# Altium schematic sheet PowerUnit.SchDoc
size A4
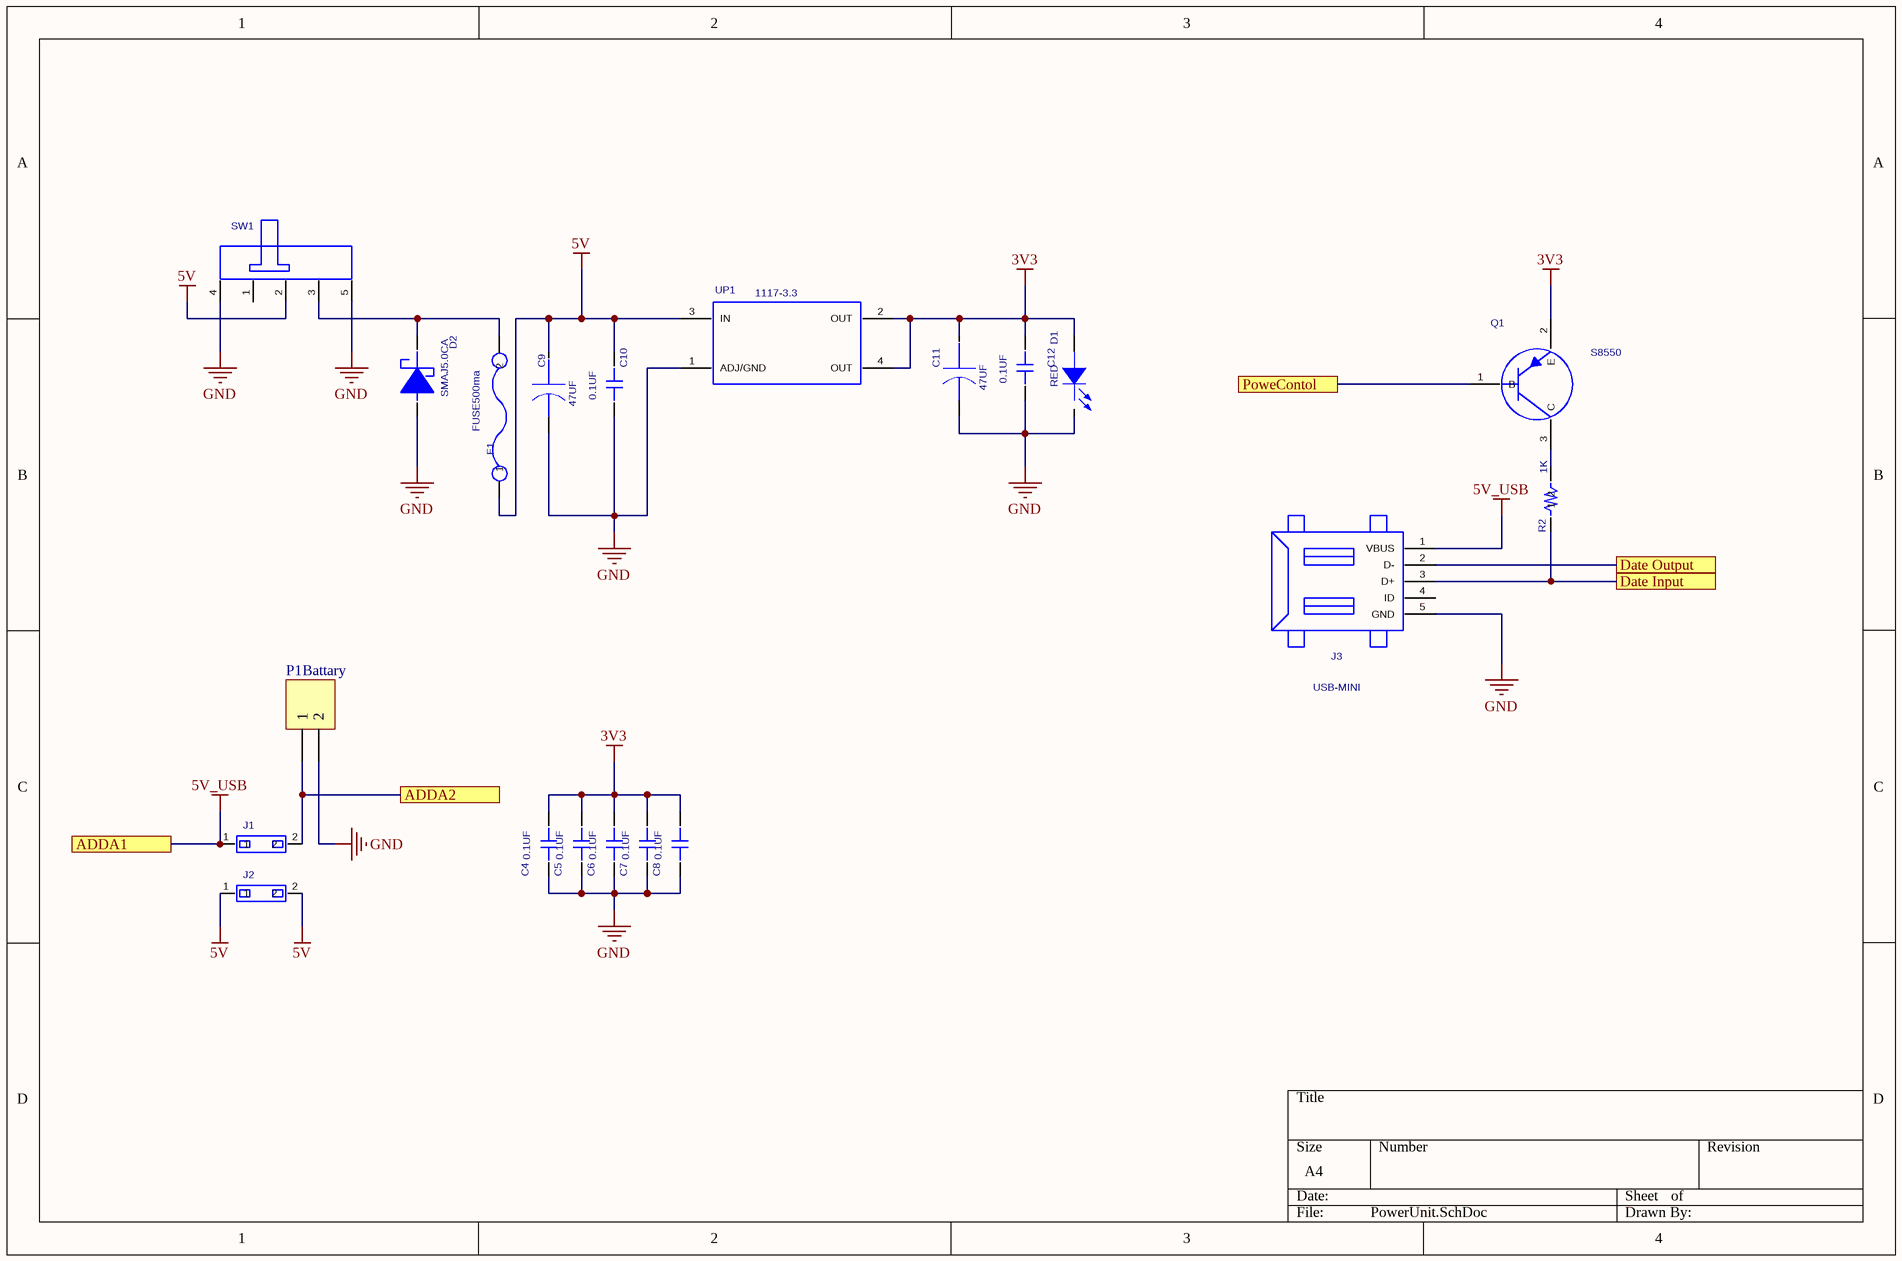
[diagram p0: PowerUnit.SchDoc]

## Parts
C4  value 0.1UF  [CAP_0603_FIRE]  (hidden comment: CAP_0.1UF_0603_FIRE)
C5  value 0.1UF  [CAP_0603_FIRE]  (hidden comment: CAP_0.1UF_0603_FIRE)
C6  value 0.1UF  [CAP_0603_FIRE]  (hidden comment: CAP_0.1UF_0603_FIRE)
C7  value 0.1UF  [CAP_0603_FIRE]  (hidden comment: CAP_0.1UF_0603_FIRE)
C8  value 0.1UF  [CAP_0603_FIRE]  (hidden comment: CAP_0.1UF_0603_FIRE)
C9  value 47UF  [CAP+_47UF_FIRE]  (hidden comment: CAP+_47UF_FIRE)
C10  value 0.1UF  [CAP_0603_FIRE]  (hidden comment: CAP_0.1UF_0603_FIRE)
C11  value 47UF  [CAP+_47UF_FIRE]  (hidden comment: CAP+_47UF_FIRE)
C12  value 0.1UF  [CAP_0603_FIRE]  (hidden comment: CAP_0.1UF_0603_FIRE)
D1  value RED  [LED_RED_0603_FIRE]  (hidden comment: LED_RED_0603_FIRE)
D2  SMAJ5.0CA  [DO-214]
F1  FUSE500MA  [C1812]
J1  1X2PIN_SMD  [1X2PIN_SMD]  (value not drawn)
J2  1X2PIN_SMD  [1X2PIN_SMD]  (value not drawn)
J3  USB-MINI  [USB-MINI]
P1  Battary  [HDR1X2]
Q1  S8550  [SOT-23]
R2  value 1K  [RES_0603_FIRE]  (hidden comment: RES_1K_0603_FIRE)
SW1  SW-POWER  [SW13_6]  (value not drawn)
UP1  1117-3.3

## Ports
ADDA1, ADDA2, Date Input, Date Output, PoweContol

## Nets
3V3: C4.2 C5.2 C6.2 C7.2 C8.2 C11.1 C12.2 D1.A(ANODE) Q1.2(E) UP1.2(OUT) UP1.4(OUT)
5V: C9.1 C10.2 F1.1 J2.1 J2.2 SW1.2 UP1.3(IN)
5V_USB: J1.1 J3.1(VBUS) ; port ADDA1
GND: C4.1 C5.1 C6.1 C7.1 C8.1 C9.2 C10.1 C11.2 C12.1 D1.K(CATHODE) D2.1(+) J3.5(GND) P1.2 SW1.4 SW1.5 UP1.1(ADJ/GND)
ADDA2: J1.2 P1.1 ; port ADDA2
Date Input: J3.3(D+) R2.1 ; port Date Input
Date Output: J3.2(D-) ; port Date Output
PoweContol: Q1.1(B) ; port PoweContol
NetD2_2: D2.2(-) F1.2 SW1.3
NetQ1_3: Q1.3(C) R2.2

Not connected (* = marked no-connect by the designer): J3 4(ID); SW1 1

## Library data of the parts
C4-C8 C10 C12 = CAP_0.1UF_0603_FIRE: SURFACE MOUNT CAPACITOR 0.031 X 0.061 INCHES; PCB DECAL: CAP_0603_FIRE
D1 = LED_RED_0603_FIRE: red,0805; PCB DECAL: LED_RED_0603_FIRE
F1 = FUSE500MA: Assembly: SMD; Protel.FootprintDescription: Chip Capacitor, 2-Leads, Body 4.6x3.2mm, IP; Manufacture 1 P/N: FUSE500ma; Value: FUSE500ma; PCB DECAL: C1812
P1 = Header 2: Header, 2-Pin; LatestRevisionDate: 17-Jul-2002; LatestRevisionNote: Re-released for DXP Platform.; Publisher: Altium Limited
Q1 = S8550: NPN; Manufacturer #2: 8050; PCB DECAL: SOT-23
R2 = RES_1K_0603_FIRE: 0402; Manufacture 1: SUPEROHM; Tolerance: +-5%; Assembly: SMD; PCB DECAL: RES_0603_FIRE
SW1 = SW-POWER: SW-5; Manufacturer #1 PN: SW-5; PCB DECAL: SW13_6
UP1 = 1117-3.3: SOT-223; Manufacturer #1: SPX; Geometry.Height: 62.99mil; Manufacturer #1 PN: 1117-3.3
C9 C11 = CAP+_47UF_FIRE: PCB DECAL: CAP+_47UF_FIRE
D2 = SMAJ5.0CA: Value: SMAJ5.0CA; PCB DECAL: DO-214
J1 J2 = 1X2PIN_SMD: PCB DECAL: 1X2PIN_SMD
J3 = USB-MINI: PCB DECAL: USB-MINI